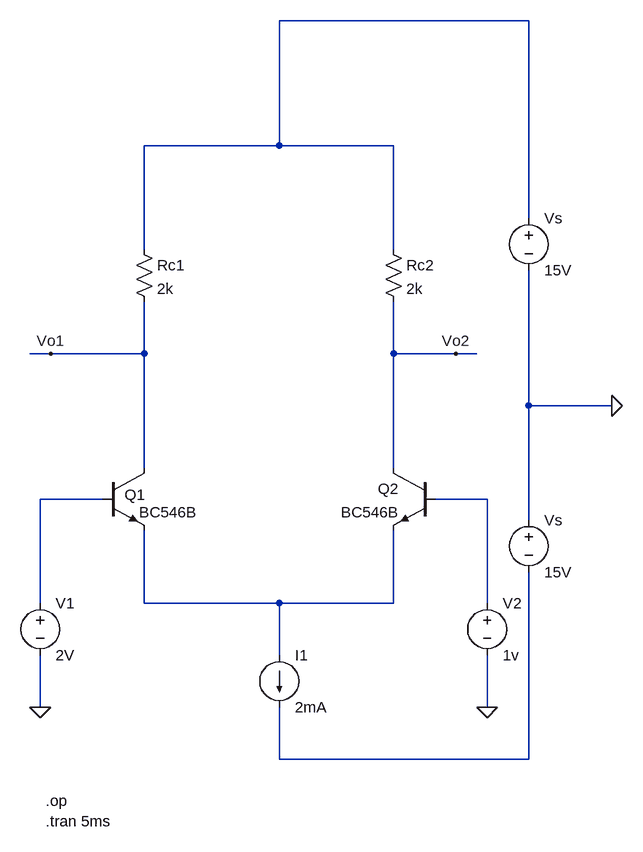
[diagram p0: schematic DifferentialAmplifier.asc]
DifferentialAmplifier.asc, the LTspice schematic file:
Version 4
SHEET 1 1008 980
WIRE 864 -256 480 -256
WIRE 480 -64 480 -256
WIRE 480 -64 272 -64
WIRE 656 -64 480 -64
WIRE 864 48 864 -256
WIRE 272 96 272 -64
WIRE 656 96 656 -64
WIRE 128 256 96 256
WIRE 272 256 272 176
WIRE 272 256 128 256
WIRE 656 256 656 176
WIRE 752 256 656 256
WIRE 784 256 752 256
WIRE 864 336 864 128
WIRE 992 336 864 336
WIRE 272 432 272 256
WIRE 656 432 656 256
WIRE 208 480 112 480
WIRE 800 480 720 480
WIRE 864 512 864 336
WIRE 112 640 112 480
WIRE 272 640 272 528
WIRE 480 640 272 640
WIRE 656 640 656 528
WIRE 656 640 480 640
WIRE 800 640 800 480
WIRE 480 720 480 640
WIRE 112 800 112 720
WIRE 800 800 800 720
WIRE 480 880 480 800
WIRE 864 880 864 592
WIRE 864 880 480 880
FLAG 992 336 0
FLAG 112 800 0
FLAG 800 800 0
FLAG 128 256 Vo1
FLAG 752 256 Vo2
SYMBOL res 256 80 R0
SYMATTR InstName Rc1
SYMATTR Value 2k
SYMBOL res 640 80 R0
SYMATTR InstName Rc2
SYMATTR Value 2k
SYMBOL npn 208 432 R0
WINDOW 0 34 41 Left 2
SYMATTR InstName Q1
SYMATTR Value BC546B
SYMBOL npn 720 432 M0
SYMATTR InstName Q2
SYMATTR Value BC546B
SYMBOL current 480 720 R0
SYMATTR InstName I1
SYMATTR Value 2mA
SYMBOL voltage 864 32 R0
SYMATTR InstName Vs
SYMATTR Value 15V
SYMBOL voltage 864 496 R0
SYMATTR InstName Vs
SYMATTR Value 15V
SYMBOL voltage 112 624 R0
SYMATTR InstName V1
SYMATTR Value 2V
SYMBOL voltage 800 624 R0
SYMATTR InstName V2
SYMATTR Value 1v
TEXT 120 944 Left 2 !.op\n.tran 5ms

The netlist it stands for:
* DifferentialAmplifier.asc
Rc1 N001 Vo1 2k
Rc2 N001 Vo2 2k
Q1 Vo1 N002 N004 0 BC546B
Q2 Vo2 N003 N004 0 BC546B
I1 N004 N005 2mA
Vs N001 0 15V
Vs 0 N005 15V
V1 N002 0 2V
V2 N003 0 1v
.model NPN NPN
.model PNP PNP
.lib standard.bjt
.op
.tran 5ms
.backanno
.end